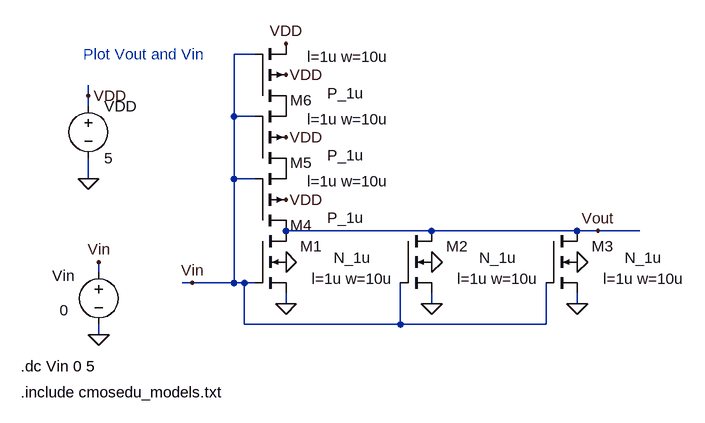
[diagram p0: schematic Fig12_5.asc]
Fig12_5.asc, the LTspice schematic file:
Version 4
SHEET 1 1136 680
WIRE 448 -432 416 -432
WIRE 192 -368 192 -384
WIRE 192 -352 192 -368
WIRE 416 -336 416 -432
WIRE 448 -336 416 -336
WIRE 192 -240 192 -272
WIRE 416 -240 416 -336
WIRE 448 -240 416 -240
WIRE 720 -160 496 -160
WIRE 944 -160 720 -160
WIRE 976 -160 944 -160
WIRE 1040 -160 976 -160
WIRE 208 -96 208 -112
WIRE 352 -80 336 -80
WIRE 416 -80 416 -240
WIRE 416 -80 352 -80
WIRE 432 -80 416 -80
WIRE 448 -80 432 -80
WIRE 496 -48 496 -64
WIRE 720 -48 720 -64
WIRE 944 -48 944 -64
WIRE 432 -16 432 -80
WIRE 672 -16 672 -80
WIRE 672 -16 432 -16
WIRE 896 -16 896 -80
WIRE 896 -16 672 -16
WIRE 208 0 208 -16
FLAG 208 0 0
FLAG 208 -112 Vin
FLAG 192 -240 0
FLAG 192 -368 VDD
FLAG 496 -400 VDD
FLAG 496 -48 0
FLAG 496 -448 VDD
FLAG 352 -80 Vin
FLAG 976 -160 Vout
FLAG 496 -112 0
FLAG 720 -48 0
FLAG 720 -112 0
FLAG 944 -48 0
FLAG 944 -112 0
FLAG 496 -304 VDD
FLAG 496 -208 VDD
SYMBOL voltage 208 -112 R0
WINDOW 0 -72 21 Left 2
WINDOW 3 -60 74 Left 2
WINDOW 123 0 0 Left 2
WINDOW 39 0 0 Left 2
SYMATTR InstName Vin
SYMATTR Value 0
SYMBOL voltage 192 -368 R0
WINDOW 123 0 0 Left 2
WINDOW 39 0 0 Left 2
SYMATTR InstName VDD
SYMATTR Value 5
SYMBOL pmos4 448 -352 M180
WINDOW 0 88 9 Right 2
WINDOW 3 168 20 Right 2
WINDOW 123 206 76 Right 2
SYMATTR InstName M6
SYMATTR Value P_1u
SYMATTR Value2 l=1u w=10u
SYMBOL nmos4 448 -160 R0
WINDOW 0 104 24 Right 2
WINDOW 3 179 41 Right 2
WINDOW 123 213 74 Right 2
SYMATTR InstName M1
SYMATTR Value N_1u
SYMATTR Value2 l=1u w=10u
SYMBOL nmos4 672 -160 R0
WINDOW 0 104 24 Right 2
WINDOW 3 179 41 Right 2
WINDOW 123 213 74 Right 2
SYMATTR InstName M2
SYMATTR Value N_1u
SYMATTR Value2 l=1u w=10u
SYMBOL nmos4 896 -160 R0
WINDOW 0 104 24 Right 2
WINDOW 3 179 41 Right 2
WINDOW 123 213 74 Right 2
SYMATTR InstName M3
SYMATTR Value N_1u
SYMATTR Value2 l=1u w=10u
SYMBOL pmos4 448 -256 M180
WINDOW 0 88 9 Right 2
WINDOW 3 168 20 Right 2
WINDOW 123 206 76 Right 2
SYMATTR InstName M5
SYMATTR Value P_1u
SYMATTR Value2 l=1u w=10u
SYMBOL pmos4 448 -160 M180
WINDOW 0 88 9 Right 2
WINDOW 3 168 20 Right 2
WINDOW 123 206 76 Right 2
SYMATTR InstName M4
SYMATTR Value P_1u
SYMATTR Value2 l=1u w=10u
TEXT 88 48 Left 2 !.dc Vin 0 5
TEXT 88 88 Left 2 !.include cmosedu_models.txt
TEXT 184 -432 Left 2 ;Plot Vout and Vin

The netlist it stands for:
* Fig12_5.asc
Vin Vin 0 0
VDD VDD 0 5
M6 P001 Vin VDD VDD P_1u l=1u w=10u
M1 Vout Vin 0 0 N_1u l=1u w=10u
M2 Vout Vin 0 0 N_1u l=1u w=10u
M3 Vout Vin 0 0 N_1u l=1u w=10u
M5 P002 Vin P001 VDD P_1u l=1u w=10u
M4 Vout Vin P002 VDD P_1u l=1u w=10u
.model NMOS NMOS
.model PMOS PMOS
.lib standard.mos
.dc Vin 0 5
.include cmosedu_models.txt
* Plot Vout and Vin
.backanno
.end